# EasyEDA schematic SCH_ShieldV1.1.sch_2022-06-14.json

## Sheets
1 Main board
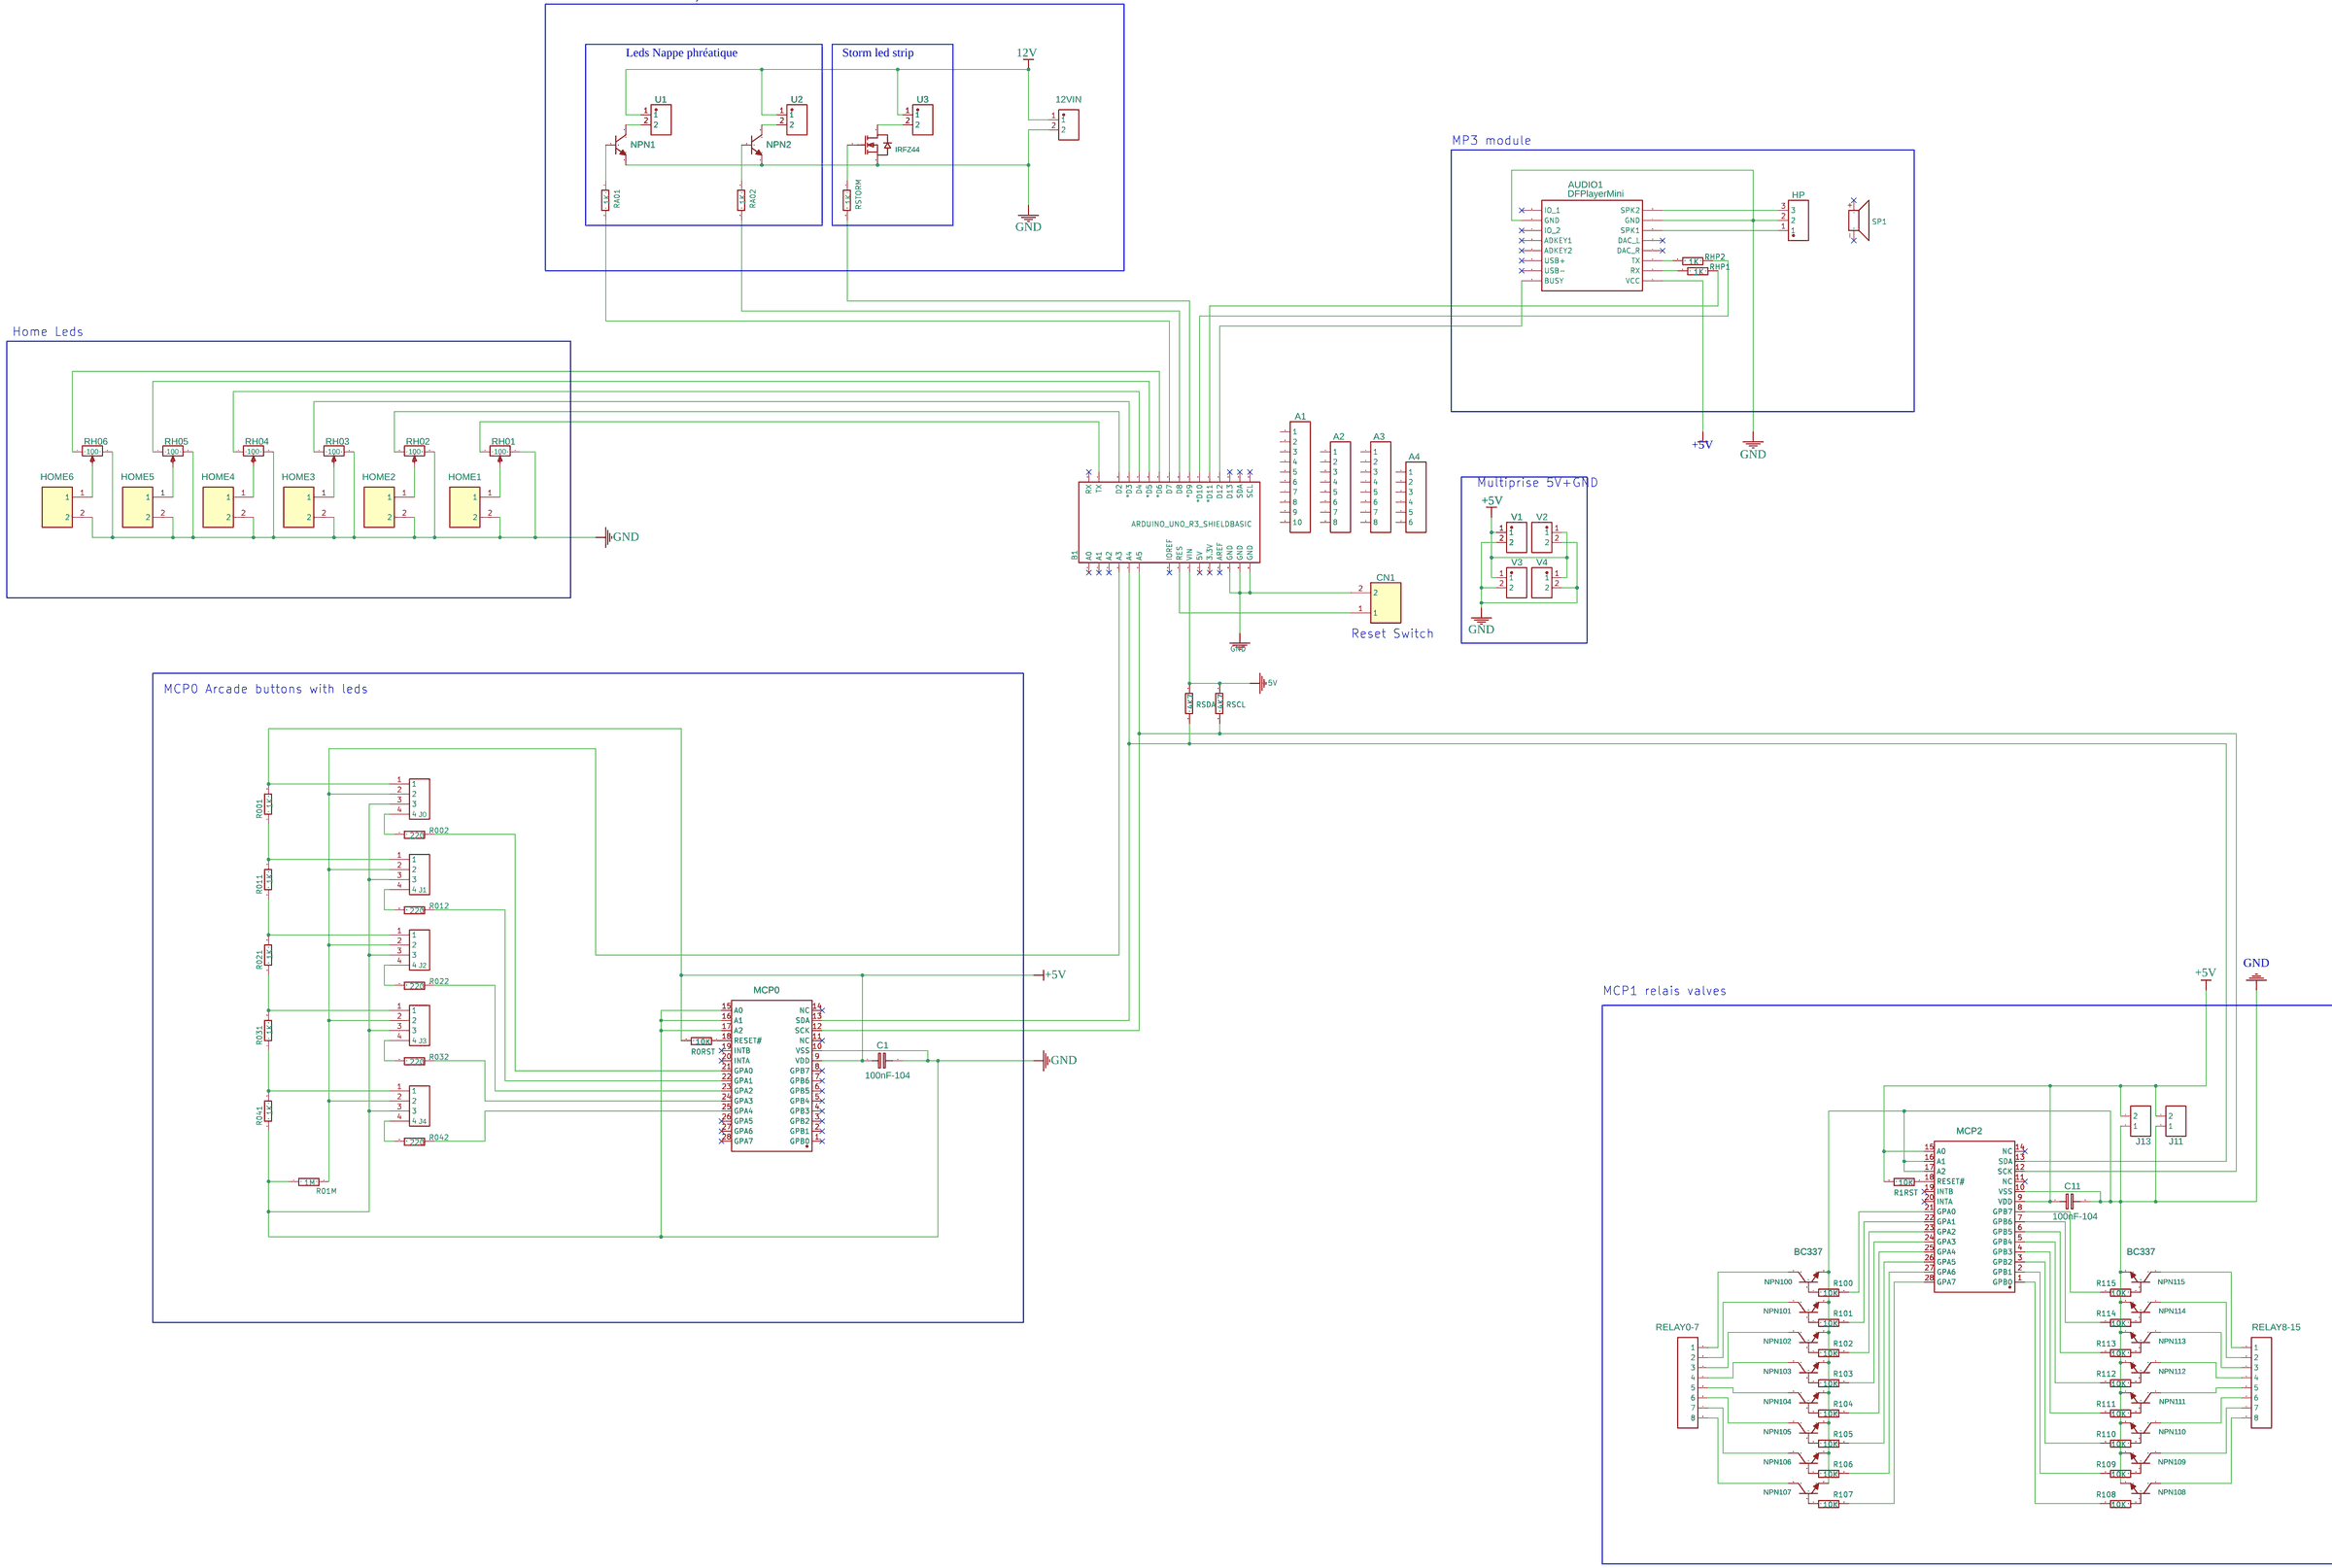
[diagram p0: Main board]
2 leds: TITLE: Sheet_2; REV: 1.0; Date: 2022-06-01; Sheet: 1/1; Drawn By: nicolas.de.barquin; Company: Your Company
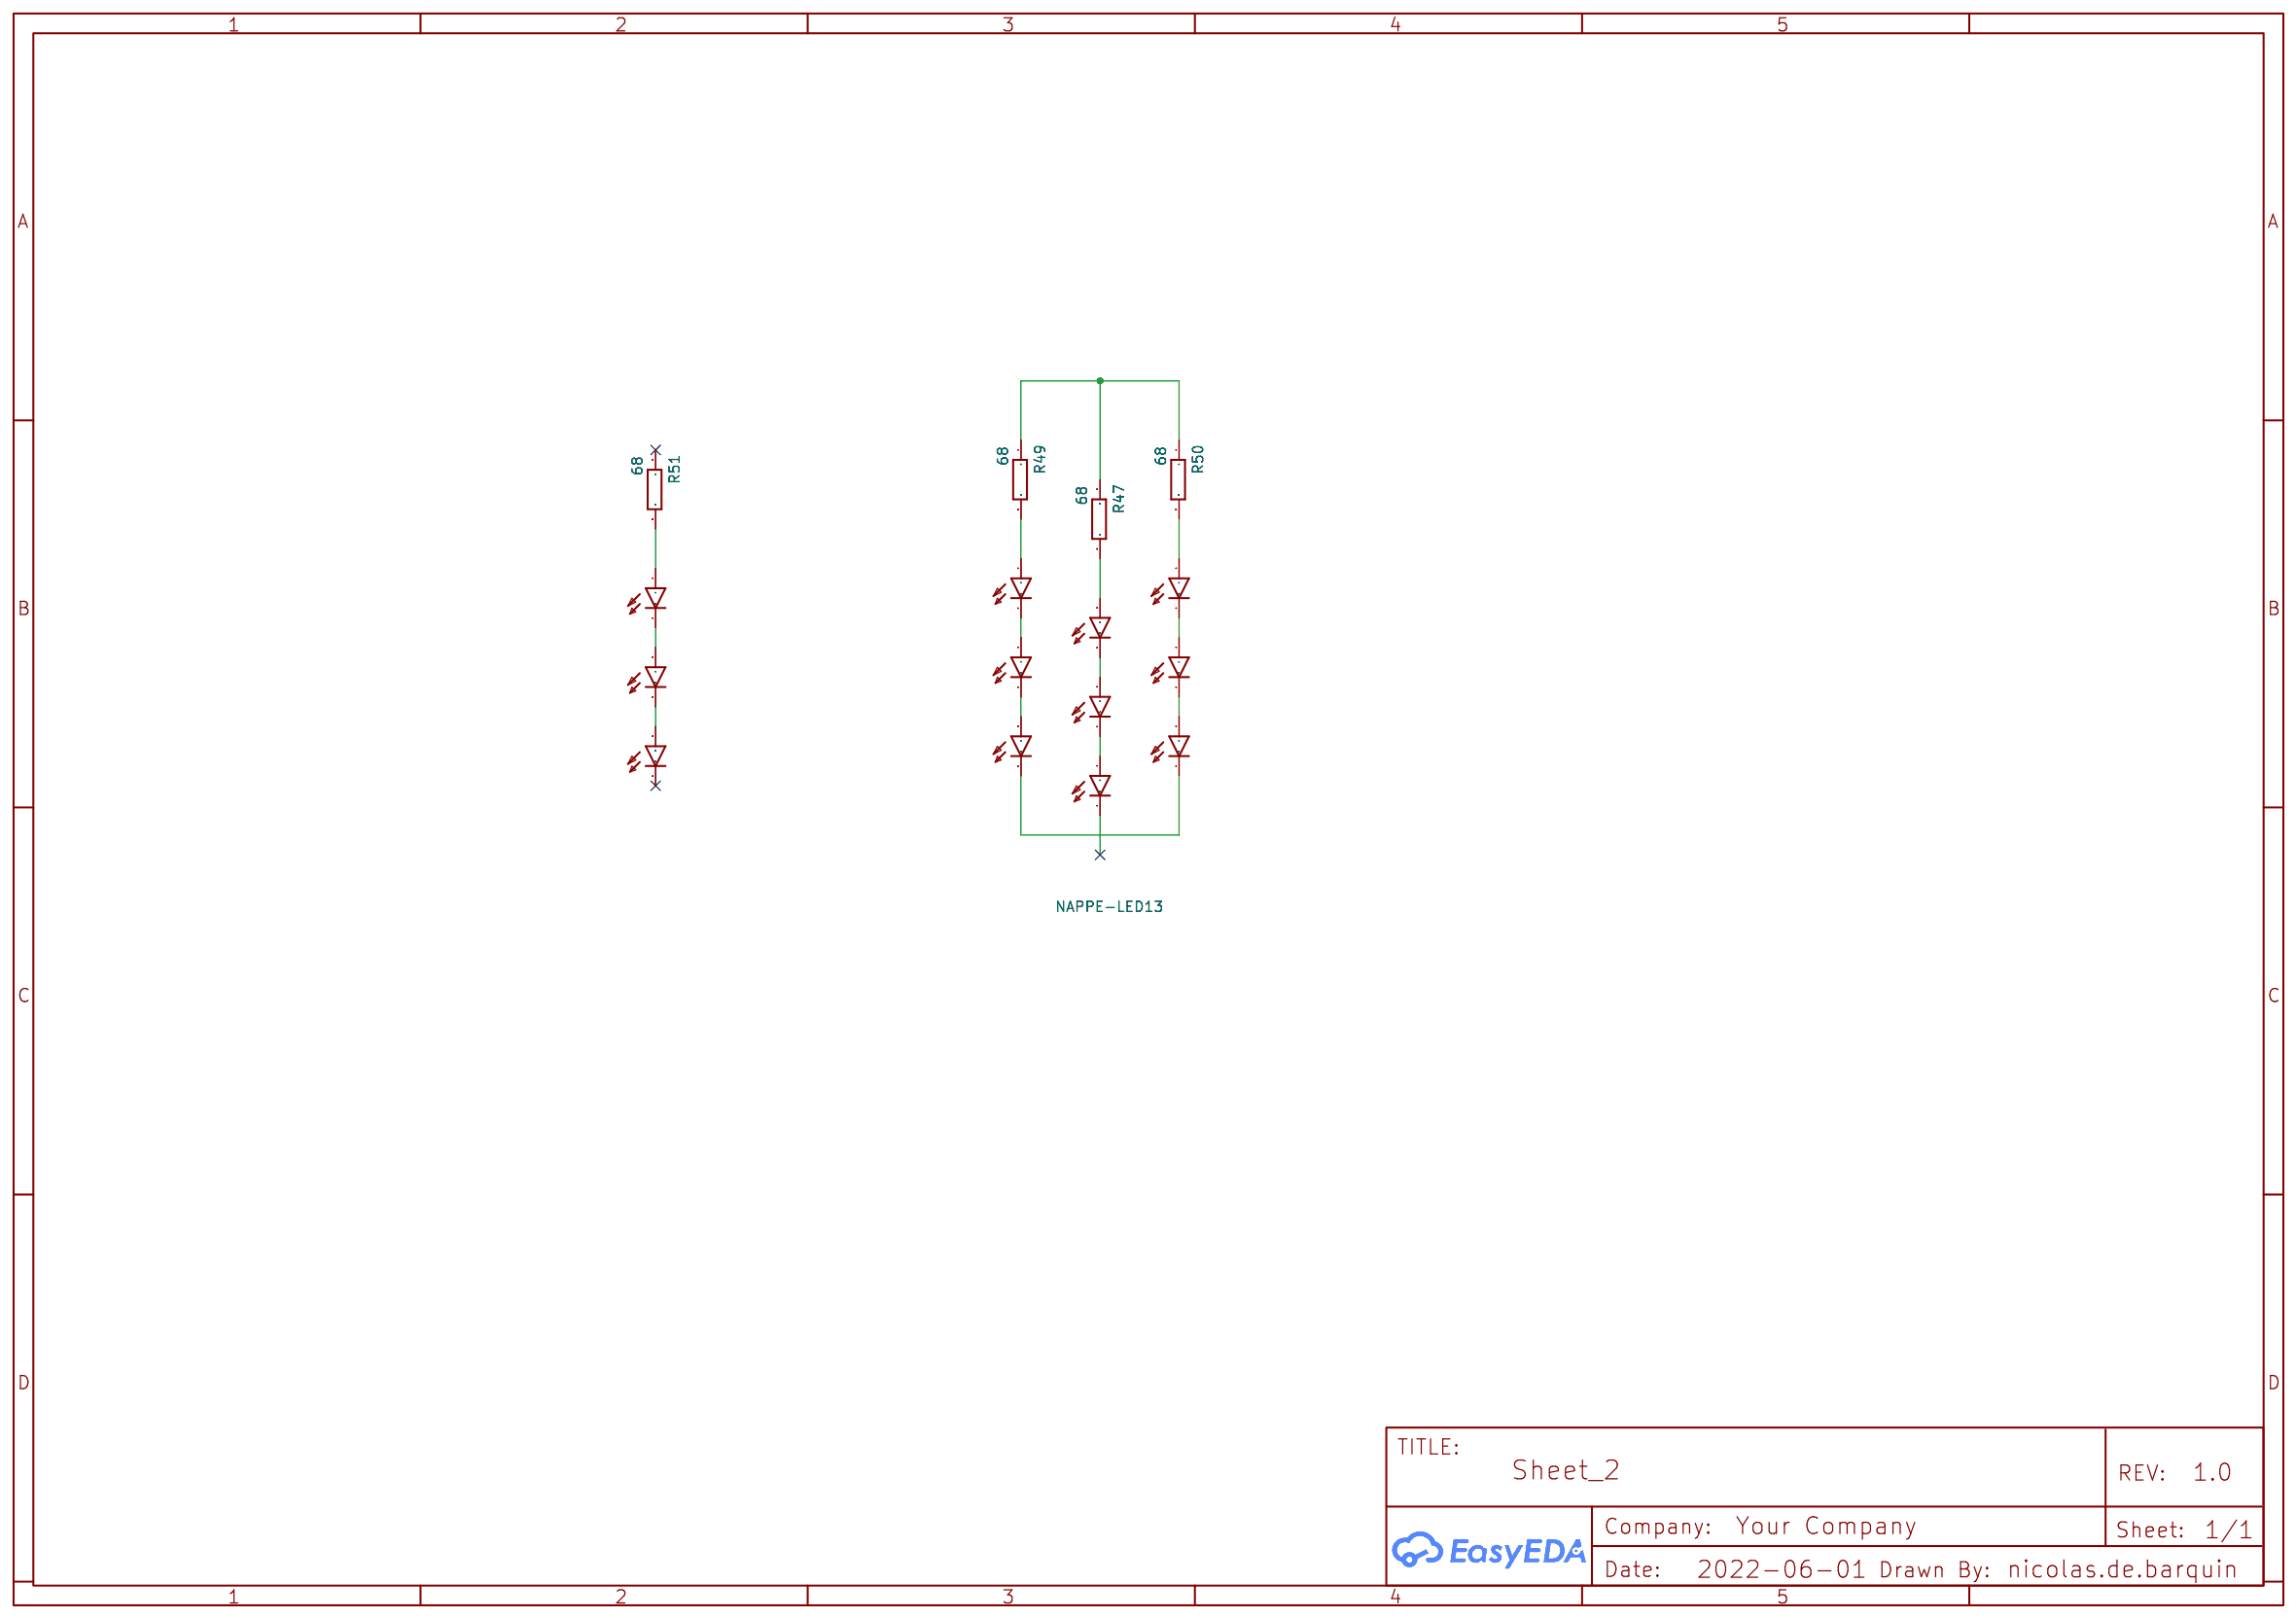
[diagram p1: leds]

## Parts
sheet leds
NAPPE-LED1  LED5MM  [LED5MM]
NAPPE-LED2  LED5MM  [LED5MM]
NAPPE-LED3  LED5MM  [LED5MM]
NAPPE-LED4  LED5MM  [LED5MM]
NAPPE-LED5  LED5MM  [LED5MM]
NAPPE-LED6  LED5MM  [LED5MM]
NAPPE-LED7  LED5MM  [LED5MM]
NAPPE-LED8  LED5MM  [LED5MM]
NAPPE-LED9  LED5MM  [LED5MM]
NAPPE-LED10  LED5MM  [LED5MM]
NAPPE-LED11  LED5MM  [LED5MM]
NAPPE-LED13  LED5MM  [LED5MM]
R47  68  [R0805]
R49  68  [R0805]
R50  68  [R0805]
R51  68  [R0805]
sheet Main board
12VIN  12V IN  [CONN-TH_P5.00_KF301-5.0-2P]
A1  HDR-M-2.54_1x10  [HDR-M-2.54_1X10]
A2  HDR-M-2.54_1x8  [HDR-M-2.54_1X8]
A3  HDR-M-2.54_1x8  [HDR-M-2.54_1X8]
A4  HDR-M-2.54_1x6  [HDR-M-2.54_1X6]
AUDIO1  DFPlayerMini  [DFPLAYER]
B1  ARDUINO_UNO_R3_SHIELDBASIC  [UNO_R3_SHIELD]
C1  100nF-104  [RAD-0.1]
C11  100nF-104  [RAD-0.1]
CN1  B2B-PH-K-S(LF)(SN)  [CONN-TH_B2B-PH-K-S]
HOME1  B2B-PH-K-S(LF)(SN)  [CONN-TH_B2B-PH-K-S]
HOME2  B2B-PH-K-S(LF)(SN)  [CONN-TH_B2B-PH-K-S]
HOME3  B2B-PH-K-S(LF)(SN)  [CONN-TH_B2B-PH-K-S]
HOME4  B2B-PH-K-S(LF)(SN)  [CONN-TH_B2B-PH-K-S]
HOME5  B2B-PH-K-S(LF)(SN)  [CONN-TH_B2B-PH-K-S]
HOME6  B2B-PH-K-S(LF)(SN)  [CONN-TH_B2B-PH-K-S]
HP  JL300-50003U01  [CONN-TH_3P-P5.08_JL300-50003U01]
IRFZ44  IRFZ44NPBF  [TO-220-3_L10.0-W4.5-P2.54-L]
J0  XHB-4A(White)/4needle  [CONN-TH_4P_XHB-4A]
J1  XHB-4A(White)/4needle  [CONN-TH_4P_XHB-4A]
J2  XHB-4A(White)/4needle  [CONN-TH_4P_XHB-4A]
J3  XHB-4A(White)/4needle  [CONN-TH_4P_XHB-4A]
J4  XHB-4A(White)/4needle  [CONN-TH_4P_XHB-4A]
J11  HDR-M-2.54_1x2  [HDR-M-2.54_1X2]
J13  HDR-M-2.54_1x2  [HDR-M-2.54_1X2]
MCP0  MCP23017-E/SP  [DIP-28_L35.0-W6.5-P2.54-LS7.6-BL]
MCP2  MCP23017-E/SP  [DIP-28_L35.0-W6.5-P2.54-LS7.6-BL]
NPN1  2N4401_C15986  [TO-92-3_L4.9-W3.7-P1.27-L]
NPN2  2N4401_C15986  [TO-92-3_L4.9-W3.7-P1.27-L]
NPN100  BC337  [TO-92-3_L4.9-W3.7-P1.27-L]
NPN101  BC337  [TO-92-3_L4.9-W3.7-P1.27-L]
NPN102  BC337  [TO-92-3_L4.9-W3.7-P1.27-L]
NPN103  BC337  [TO-92-3_L4.9-W3.7-P1.27-L]
NPN104  BC337  [TO-92-3_L4.9-W3.7-P1.27-L]
NPN105  BC337  [TO-92-3_L4.9-W3.7-P1.27-L]
NPN106  BC337  [TO-92-3_L4.9-W3.7-P1.27-L]
NPN107  BC337  [TO-92-3_L4.9-W3.7-P1.27-L]
NPN108  BC337  [TO-92-3_L4.9-W3.7-P1.27-L]
NPN109  BC337  [TO-92-3_L4.9-W3.7-P1.27-L]
NPN110  BC337  [TO-92-3_L4.9-W3.7-P1.27-L]
NPN111  BC337  [TO-92-3_L4.9-W3.7-P1.27-L]
NPN112  BC337  [TO-92-3_L4.9-W3.7-P1.27-L]
NPN113  BC337  [TO-92-3_L4.9-W3.7-P1.27-L]
NPN114  BC337  [TO-92-3_L4.9-W3.7-P1.27-L]
NPN115  BC337  [TO-92-3_L4.9-W3.7-P1.27-L]
R0RST  10K  [R0805]
R001  1K  [R0805]
R01M  1M  [R0805]
R1RST  10K  [R0805]
R002  220  [R0805]
R011  1K  [R0805]
R012  220  [R0805]
R021  1K  [R0805]
R022  220  [R0805]
R031  1K  [R0805]
R032  220  [R0805]
R041  1K  [R0805]
R042  220  [R0805]
R100  10K  [R0805]
R101  10K  [R0805]
R102  10K  [R0805]
R103  10K  [R0805]
R104  10K  [R0805]
R105  10K  [R0805]
R106  10K  [R0805]
R107  10K  [R0805]
R108  10K  [R0805]
R109  10K  [R0805]
R110  10K  [R0805]
R111  10K  [R0805]
R112  10K  [R0805]
R113  10K  [R0805]
R114  10K  [R0805]
R115  10K  [R0805]
RA01  1K  [R0805]
RA02  1K  [R0805]
RELAY0-7  HDR-M-2.54_1x8  [HDR-M-2.54_1X8]
RELAY8-15  HDR-M-2.54_1x8  [HDR-M-2.54_1X8]
RH01  100  [RES-ADJ-SMD_GF063P1]
RH02  100  [RES-ADJ-SMD_GF063P1]
RH03  100  [RES-ADJ-SMD_GF063P1]
RH04  100  [RES-ADJ-SMD_GF063P1]
RH05  100  [RES-ADJ-SMD_GF063P1]
RH06  100  [RES-ADJ-SMD_GF063P1]
RHP1  1K  [R0805]
RHP2  1K  [R0805]
RSCL  4K7  [R0805]
RSDA  4K7  [R0805]
RSTORM  1K  [R0805]
SP1  SMS-1308MS-2-R  [SMS-1308MS-2-R]
U1  KF301-5.0-2P  [CONN-TH_P5.00_KF301-5.0-2P]
U2  KF301-5.0-2P  [CONN-TH_P5.00_KF301-5.0-2P]
U3  KF301-5.0-2P  [CONN-TH_P5.00_KF301-5.0-2P]
V1  12V IN  [CONN-TH_P5.00_KF301-5.0-2P]
V2  12V IN  [CONN-TH_P5.00_KF301-5.0-2P]
V3  12V IN  [CONN-TH_P5.00_KF301-5.0-2P]
V4  12V IN  [CONN-TH_P5.00_KF301-5.0-2P]

## Library data of the parts
12VIN U1-U3 V1-V4 = KF301-5.0-2P: Supplier: LCSC; Supplier Part: C474881; Manufacturer: Cixi Kefa Elec; Contributor: LCSC; JLCPCB Part Class: Extended Part
A1 = HDR-M-2.54_1x10: Supplier Part: C57369; Supplier: LCSC; Contributor: LCEDA_Lib
A2 A3 RELAY0-7 RELAY8-15 = HDR-M-2.54_1x8: Supplier Part: C190820; Supplier: LCSC; Contributor: LCEDA_Lib
A4 = HDR-M-2.54_1x6: Supplier Part: C190819; Supplier: LCSC; Contributor: LCEDA_Lib
AUDIO1 = DFPlayerMini: catid: 20; Contributor: Outheader2; Manufacturer Part: DFPlayer mini; sim: true
C1 C11 = C_RAD-0.1_EU: Contributor: LCEDA_Lib
CN1 HOME1-HOME6 = B2B-PH-K-S(LF)(SN): Supplier: LCSC; Manufacturer: JST; Contributor: LCSC; Supplier Part: C131337; JLCPCB Part Class: Extended Part
HP = JL300-50003U01: Supplier: LCSC; Supplier Part: C394552; Manufacturer: JILN; Contributor: LCSC; JLCPCB Part Class: Extended Part
IRFZ44 = IRFZ44NPBF: Supplier: LCSC; Manufacturer: IR; Supplier Part: C2586; JLCPCB Part Class: Extended Part
J0-J4 = XHB-4A(White)/4needle: Supplier: LCSC; Manufacturer: BOOMELE; Supplier Part: C61277; JLCPCB Part Class: Extended Part
J11 J13 = HDR-M-2.54_1x2: Supplier Part: C124375; Supplier: LCSC; Contributor: LCEDA_Lib
MCP0 MCP2 = MCP23017-E/SP: Supplier: LCSC; Supplier Part: C647352; Manufacturer: Microchip Tech; Contributor: LCSC; JLCPCB Part Class: Extended Part
NPN1 NPN2 = 2N4401_C15986: Supplier: LCSC; Manufacturer: CJ; Manufacturer Part: 2N4401; Supplier Part: C15986; JLCPCB Part Class: Extended Part
NPN100-NPN115 = BC337-16: Supplier: LCSC; Supplier Part: C713609; Manufacturer: LGE; Contributor: LCSC; JLCPCB Part Class: Extended Part
RH01 RH02 RH03 RH04 RH05 RH06 = GF063P1-B101: Supplier: LCSC; Manufacturer: TOCOS; Supplier Part: C128075; JLCPCB Part Class: Extended Part

## Nets
12V: 12VIN.1 U1.1 U2.1 U3.1
+5V: AUDIO1.1(VCC) B1.VIN C1.1 C11.1 J0.1 J11.2 J13.2 MCP0.9(VDD) MCP2.9(VDD) MCP2.15(A0) R0RST.2 R001.2 R1RST.2 RSCL.1 RSDA.1 V1.1 V2.1 V3.1 V4.1
GND: 12VIN.2 AUDIO1.7(GND) AUDIO1.15(GND) B1.GND@0(GND) B1.GND@1(GND) B1.GND@2(GND) C1.2 C11.2 CN1.2 HOME1.2 HOME2.2 HOME3.2 HOME4.2 HOME5.2 HOME6.2 HP.2 IRFZ44.3(S) J0.3 J1.3 J2.3 J3.3 J4.3 J11.1 J13.1 MCP0.10(VSS) MCP0.15(A0) MCP0.16(A1) MCP0.17(A2) MCP2.10(VSS) MCP2.16(A1) MCP2.17(A2) NPN1.1(E) NPN2.1(E) NPN100.3(E) NPN101.3(E) NPN102.3(E) NPN103.3(E) NPN104.3(E) NPN105.3(E) NPN106.3(E) NPN107.3(E) NPN108.3(E) NPN109.3(E) NPN110.3(E) NPN111.3(E) NPN112.3(E) NPN113.3(E) NPN114.3(E) NPN115.3(E) R01M.2 R041.1 RH01.3 RH02.3 RH03.3 RH04.3 RH05.3 RH06.3 V1.2 V2.2 V3.2 V4.2
Net-(AUDIO1-2): AUDIO1.2(RX) RHP1.2
Net-(AUDIO1-3): AUDIO1.3(TX) RHP2.1
Net-(AUDIO1-6): AUDIO1.6(SPK1) HP.1
Net-(AUDIO1-8): AUDIO1.8(SPK2) HP.3
Net-(AUDIO1-9): AUDIO1.9(BUSY) B1.D12
Net-(B1-A3): B1.A3 J0.2 J1.2 J2.2 J3.2 J4.2 R01M.1
Net-(B1-A4): B1.A4 MCP0.13(SDA) MCP2.13(SDA) RSDA.2
Net-(B1-A5): B1.A5 MCP0.12(SCK) MCP2.12(SCK) RSCL.2
Net-(B1-D2): B1.D2 RH02.1
Net-(B1-D3): B1.D3(*D3) RH03.1
Net-(B1-D4): B1.D4 RH04.1
Net-(B1-D5): B1.D5(*D5) RH05.1
Net-(B1-D6): B1.D6(*D6) RH06.1
Net-(B1-D7): B1.D7 RA01.2
Net-(B1-D8): B1.D8 RA02.2
Net-(B1-D9): B1.D9(*D9) RSTORM.2
Net-(B1-D10): B1.D10(*D10) RHP2.2
Net-(B1-D11): B1.D11(*D11) RHP1.1
Net-(B1-RES): B1.RES CN1.1
Net-(B1-TX): B1.TX RH01.1
Net-(HOME1-1): HOME1.1 RH01.2
Net-(HOME2-1): HOME2.1 RH02.2
Net-(HOME3-1): HOME3.1 RH03.2
Net-(HOME4-1): HOME4.1 RH04.2
Net-(HOME5-1): HOME5.1 RH05.2
Net-(HOME6-1): HOME6.1 RH06.2
Net-(IRFZ44-1): IRFZ44.1(G) RSTORM.1
Net-(IRFZ44-2): IRFZ44.2(D) U3.2
Net-(J0-4): J0.4 R002.2
Net-(J1-1): J1.1 R001.1 R011.2
Net-(J1-4): J1.4 R012.2
Net-(J2-1): J2.1 R011.1 R021.2
Net-(J2-4): J2.4 R022.2
Net-(J3-1): J3.1 R021.1 R031.2
Net-(J3-4): J3.4 R032.2
Net-(J4-1): J4.1 R031.1 R041.2
Net-(J4-4): J4.4 R042.2
Net-(MCP0-18): MCP0.18(RESET#) R0RST.1
Net-(MCP0-21): MCP0.21(GPA0) R002.1
Net-(MCP0-22): MCP0.22(GPA1) R012.1
Net-(MCP0-23): MCP0.23(GPA2) R022.1
Net-(MCP0-24): MCP0.24(GPA3) R032.1
Net-(MCP0-25): MCP0.25(GPA4) R042.1
Net-(MCP2-1): MCP2.1(GPB0) R108.2
Net-(MCP2-2): MCP2.2(GPB1) R109.2
Net-(MCP2-3): MCP2.3(GPB2) R110.2
Net-(MCP2-4): MCP2.4(GPB3) R111.2
Net-(MCP2-5): MCP2.5(GPB4) R112.2
Net-(MCP2-6): MCP2.6(GPB5) R113.2
Net-(MCP2-7): MCP2.7(GPB6) R114.2
Net-(MCP2-8): MCP2.8(GPB7) R115.2
Net-(MCP2-18): MCP2.18(RESET#) R1RST.1
Net-(MCP2-21): MCP2.21(GPA0) R100.2
Net-(MCP2-22): MCP2.22(GPA1) R101.2
Net-(MCP2-23): MCP2.23(GPA2) R102.2
Net-(MCP2-24): MCP2.24(GPA3) R103.2
Net-(MCP2-25): MCP2.25(GPA4) R104.2
Net-(MCP2-26): MCP2.26(GPA5) R105.2
Net-(MCP2-27): MCP2.27(GPA6) R106.2
Net-(MCP2-28): MCP2.28(GPA7) R107.2
Net-(NAPPE-LED1-A): NAPPE-LED1.A NAPPE-LED2.K(C)
Net-(NAPPE-LED1-K): NAPPE-LED1.K(C) NAPPE-LED13.A
Net-(NAPPE-LED2-A): NAPPE-LED2.A R47.2
Net-(NAPPE-LED3-A): NAPPE-LED3.A NAPPE-LED4.K(C)
Net-(NAPPE-LED3-K): NAPPE-LED3.K(C) NAPPE-LED6.K(C)
Net-(NAPPE-LED4-A): NAPPE-LED4.A NAPPE-LED5.K(C)
Net-(NAPPE-LED5-A): NAPPE-LED5.A R49.2
Net-(NAPPE-LED6-A): NAPPE-LED6.A NAPPE-LED7.K(C)
Net-(NAPPE-LED7-A): NAPPE-LED7.A NAPPE-LED8.K(C)
Net-(NAPPE-LED8-A): NAPPE-LED8.A R50.2
Net-(NAPPE-LED9-A): NAPPE-LED9.A NAPPE-LED10.K(C)
Net-(NAPPE-LED10-A): NAPPE-LED10.A NAPPE-LED11.K(C)
Net-(NAPPE-LED11-A): NAPPE-LED11.A R51.2
Net-(NPN1-2): NPN1.2(B) RA01.1
Net-(NPN1-3): NPN1.3(C) U1.2
Net-(NPN2-2): NPN2.2(B) RA02.1
Net-(NPN2-3): NPN2.3(C) U2.2
Net-(NPN100-1): NPN100.1(C) RELAY0-7.1
Net-(NPN100-2): NPN100.2(B) R100.1
Net-(NPN101-1): NPN101.1(C) RELAY0-7.2
Net-(NPN101-2): NPN101.2(B) R101.1
Net-(NPN102-1): NPN102.1(C) RELAY0-7.3
Net-(NPN102-2): NPN102.2(B) R102.1
Net-(NPN103-1): NPN103.1(C) RELAY0-7.4
Net-(NPN103-2): NPN103.2(B) R103.1
Net-(NPN104-1): NPN104.1(C) RELAY0-7.5
Net-(NPN104-2): NPN104.2(B) R104.1
Net-(NPN105-1): NPN105.1(C) RELAY0-7.6
Net-(NPN105-2): NPN105.2(B) R105.1
Net-(NPN106-1): NPN106.1(C) RELAY0-7.7
Net-(NPN106-2): NPN106.2(B) R106.1
Net-(NPN107-1): NPN107.1(C) RELAY0-7.8
Net-(NPN107-2): NPN107.2(B) R107.1
Net-(NPN108-1): NPN108.1(C) RELAY8-15.8
Net-(NPN108-2): NPN108.2(B) R108.1
Net-(NPN109-1): NPN109.1(C) RELAY8-15.7
Net-(NPN109-2): NPN109.2(B) R109.1
Net-(NPN110-1): NPN110.1(C) RELAY8-15.6
Net-(NPN110-2): NPN110.2(B) R110.1
Net-(NPN111-1): NPN111.1(C) RELAY8-15.5
Net-(NPN111-2): NPN111.2(B) R111.1
Net-(NPN112-1): NPN112.1(C) RELAY8-15.4
Net-(NPN112-2): NPN112.2(B) R112.1
Net-(NPN113-1): NPN113.1(C) RELAY8-15.3
Net-(NPN113-2): NPN113.2(B) R113.1
Net-(NPN114-1): NPN114.1(C) RELAY8-15.2
Net-(NPN114-2): NPN114.2(B) R114.1
Net-(NPN115-1): NPN115.1(C) RELAY8-15.1
Net-(NPN115-2): NPN115.2(B) R115.1
Net-(R47-1): R47.1 R49.1 R50.1

Not connected (* = marked no-connect by the designer): A1 1 2 3 4 5 6 7 8 9 10; A2 1 2 3 4 5 6 7 8; A3 1 2 3 4 5 6 7 8; A4 1 2 3 4 5 6; AUDIO1 4(DAC_R)* 5(DAC_L)* 10(USB-)* 11(USB+)* 12(ADKEY2)* 13(ADKEY1)* 14(IO_2)* 16(IO_1)*; B1 3.3V* 5V* A0* A1* A2* AREF* D13* IOREF* RX* SCL* SDA*; MCP0 1(GPB0)* 2(GPB1)* 3(GPB2)* 4(GPB3)* 5(GPB4)* 6(GPB5)* 7(GPB6)* 8(GPB7)* 11(NC)* 14(NC)* 19(INTB)* 20(INTA)* 26(GPA5)* 27(GPA6)* 28(GPA7)*; MCP2 11(NC)* 14(NC)* 19(INTB)* 20(INTA)*; NAPPE-LED9 K(C)*; NAPPE-LED13 K(C); R51 1*; SP1 +(1)* -(2)*

## Notes on the sheets
sheet 1
- 12V circuits LEDS arrays
- Leds Nappe phréatique
- Storm led strip
- MP3 module
- Home Leds
- Multiprise 5V+GND
- Reset Switch
- MCP0 Arcade buttons with leds
- MCP1 relais valves
